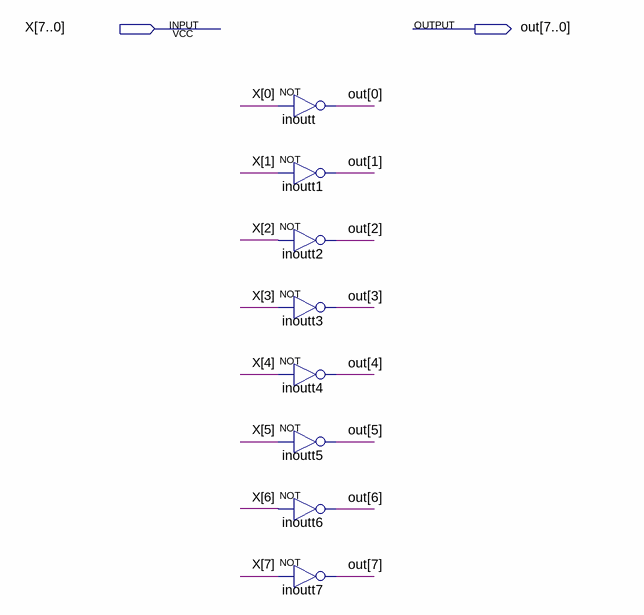
[diagram p0: schematic sheet]
// Quartus schematic NOT.bdf as structural Verilog: 8 symbols, 2 pins
module NOT (
  input  [7:0] X,
  output [7:0] out
);

  not inoutt (out[0], X[0]);
  not inoutt1 (out[1], X[1]);
  not inoutt2 (out[2], X[2]);
  not inoutt3 (out[3], X[3]);
  not inoutt4 (out[4], X[4]);
  not inoutt5 (out[5], X[5]);
  not inoutt6 (out[6], X[6]);
  not inoutt7 (out[7], X[7]);
endmodule
